# EAGLE design esquematico_proyecto (EAGLE 9.6.2)
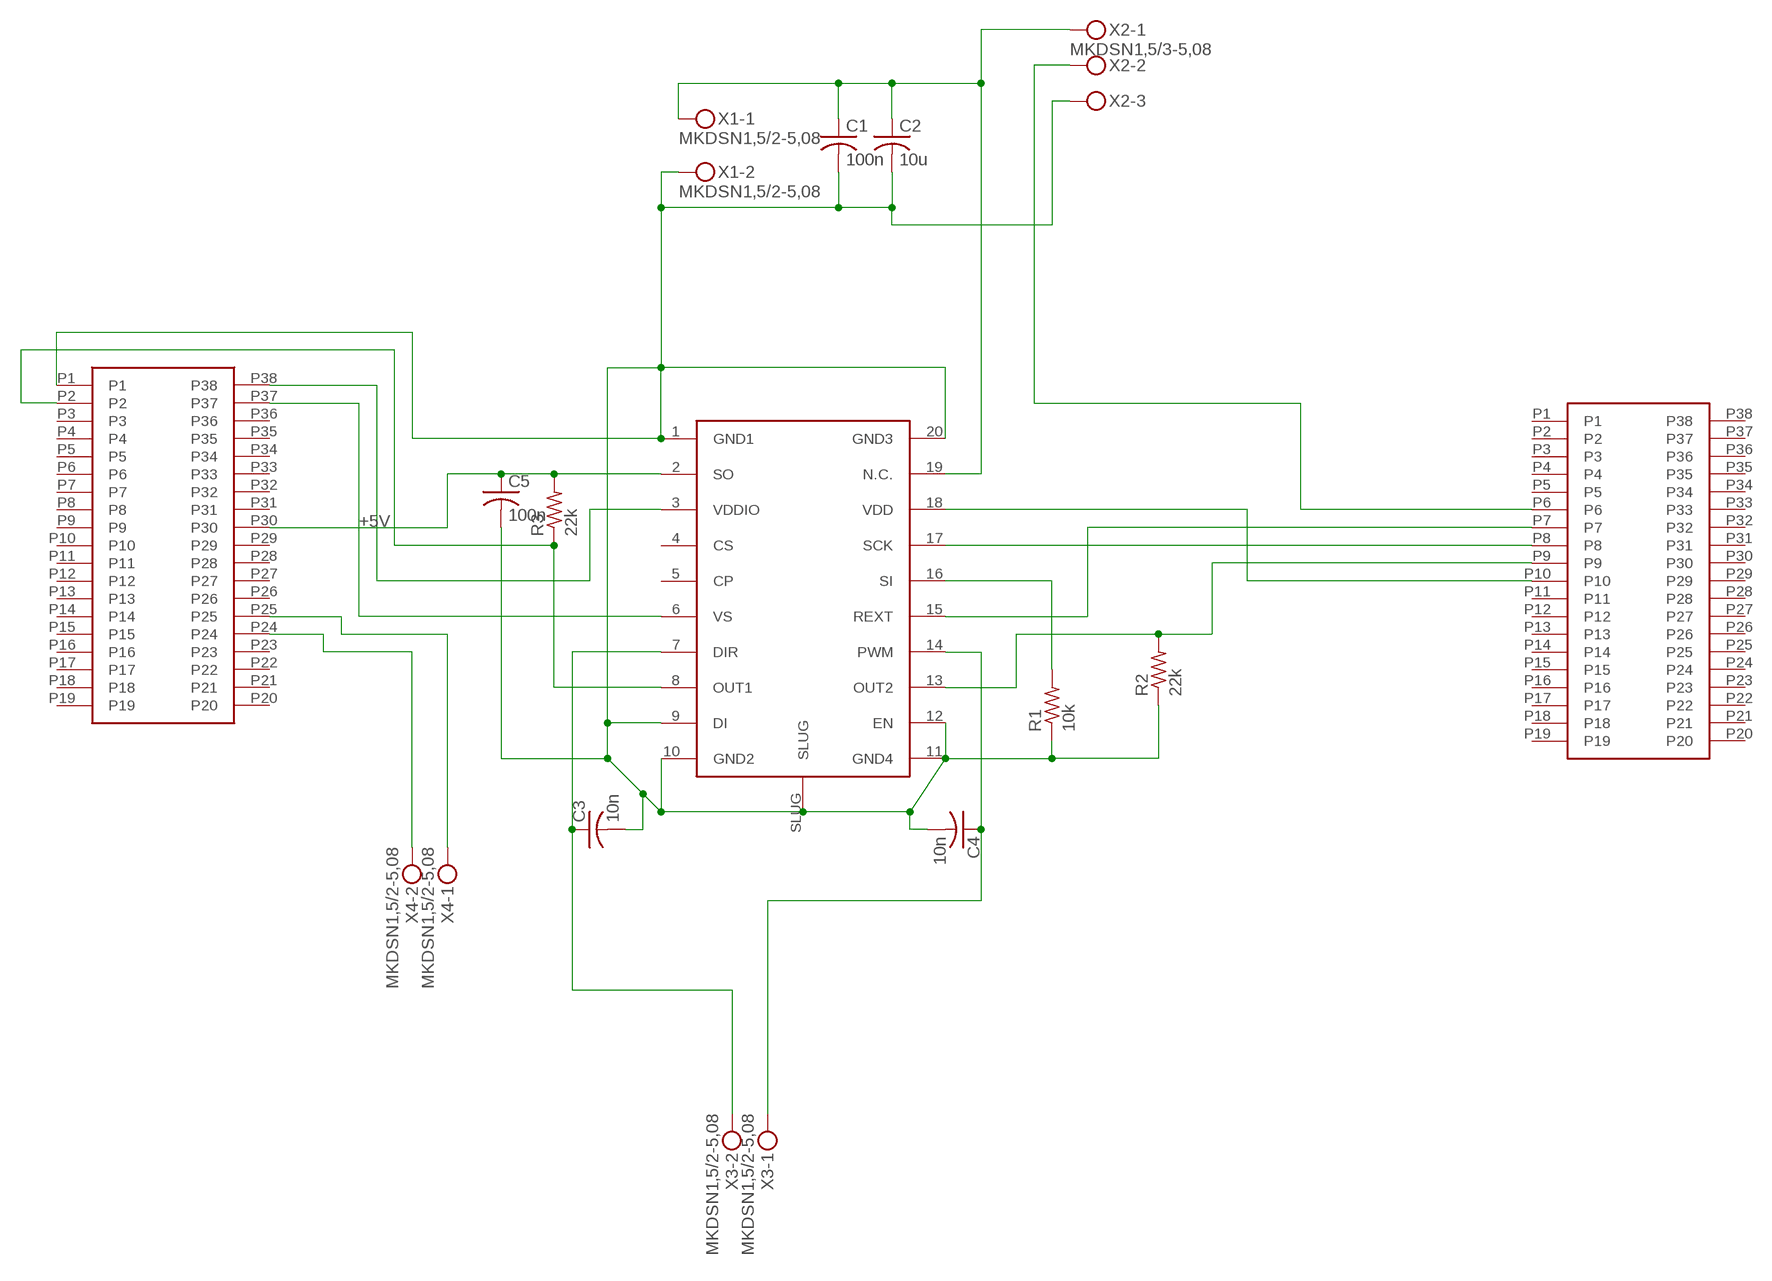
[diagram p0: schematic, sheet 1]

## Parts
C1  100n  C-USC0603  [C0603]
C2  10u  C-USC0805  [C0805]
C3  10n  C-USC0201  [C0201]
C4  10n  C-USC0201  [C0201]
C5  100n  C-USC0603  [C0603]
R1  10k  R-US_R0805  [R0805]
R2  22k  R-US_R0805  [R0805]
R3  22k  R-US_R0805  [R0805]
U$1  L9958L9958  [L9958]
U$2  PINHEADER  [PINHEADER]
U$3  PINHEADER  [PINHEADER]
X1  MKDSN1,5/2-5,08  [MKDSN1,5/2-5,08]
X2  MKDSN1,5/3-5,08  [MKDSN1,5/3-5,08]
X3  MKDSN1,5/2-5,08  [MKDSN1,5/2-5,08]
X4  MKDSN1,5/2-5,08  [MKDSN1,5/2-5,08]

## Nets
+5V: C5.1 R3.2 U$1.2(SO) U$2.P30
N$2: R1.2 U$1.16(SI)
N$3: R2.2 U$1.13(OUT2) U$3.P9
N$4: C1.1 C2.1 U$1.19(N.C.) X1.1 X2.1
N$5: C3.1 U$1.7(DIR) X3.2
N$6: C4.1 U$1.14(PWM) X3.1
N$7: R3.1 U$1.8(OUT1) U$2.P2
N$8: U$3.P6 X2.2
N$9: C1.2 C2.2 C3.2 C4.2 C5.2 R1.1 R2.1 U$1.1(GND1) U$1.9(DI) U$1.10(GND2) U$1.11(GND4) U$1.12(EN) U$1.20(GND3) U$1.SLUG U$2.P1 X1.2 X2.3
N$12: U$1.6(VS) U$2.P37
N$13: U$1.18(VDD) U$3.P10
N$14: U$1.17(SCK) U$3.P8
N$15: U$1.3(VDDIO) U$2.P38
N$16: U$1.15(REXT) U$3.P7
N$18: U$2.P25 X4.1
N$19: U$2.P24 X4.2
Unconnected: U$1.4(CS) U$1.5(CP) U$2.P3 U$2.P4 U$2.P5 U$2.P6 U$2.P7 U$2.P8 U$2.P9 U$2.P10 U$2.P11 U$2.P12 U$2.P13 U$2.P14 U$2.P15 U$2.P16 U$2.P17 U$2.P18 U$2.P19 U$2.P20 U$2.P21 U$2.P22 U$2.P23 U$2.P26 U$2.P27 U$2.P28 U$2.P29 U$2.P31 U$2.P32 U$2.P33 U$2.P34 U$2.P35 U$2.P36 U$3.P1 U$3.P2 U$3.P3 U$3.P4 U$3.P5 U$3.P11 U$3.P12 U$3.P13 U$3.P14 U$3.P15 U$3.P16 U$3.P17 U$3.P18 U$3.P19 U$3.P20 U$3.P21 U$3.P22 U$3.P23 U$3.P24 U$3.P25 U$3.P26 U$3.P27 U$3.P28 U$3.P29 U$3.P30 U$3.P31 U$3.P32 U$3.P33 U$3.P34 U$3.P35 U$3.P36 U$3.P37 U$3.P38

## Library data of the parts
C1 C2 C5 = CAPS:C-US: CAPACITOR, American symbol; SPICEPREFIX: C
C3 C4 = rcl:C-US: CAPACITOR, American symbol; SPICEPREFIX: C
R1-R3 = RES:R-US_: RESISTOR, American symbol; SPICEPREFIX: R
U$1 = L9958:L9958
U$2 U$3 = PINHEADER:PINHEADER
X1 = CONECTOR_POT:MKDSN1,5/2-5,08: MKDSN 1,5/ 2-5,08 Printklemme Nennstrom: 13,5 A Nennspannung: 250 V Rastermaß: 5,08 mm Polzahl: 2 Anschlussart: Schraubanschluss Montage: Löten Anschlussrichtung Leiter/Platine: 0 ° Artikelnummer: 1729128 Source: http://eshop.phoenixcontact.com .. 1729128.pdf
X2 = con-phoenix-508:MKDSN1,5/3-5,08: MKDSN 1,5/ 3-5,08 Printklemme Nennstrom: 13,5 A Nennspannung: 250 V Rastermaß: 5,08 mm Polzahl: 3 Anschlussart: Schraubanschluss Montage: Löten Anschlussrichtung Leiter/Platine: 0 ° Artikelnummer: 1729131 Source: http://eshop.phoenixcontact.com .. 1729131.pdf
X3 X4 = con-phoenix-508:MKDSN1,5/2-5,08: MKDSN 1,5/ 2-5,08 Printklemme Nennstrom: 13,5 A Nennspannung: 250 V Rastermaß: 5,08 mm Polzahl: 2 Anschlussart: Schraubanschluss Montage: Löten Anschlussrichtung Leiter/Platine: 0 ° Artikelnummer: 1729128 Source: http://eshop.phoenixcontact.com .. 1729128.pdf

## Board
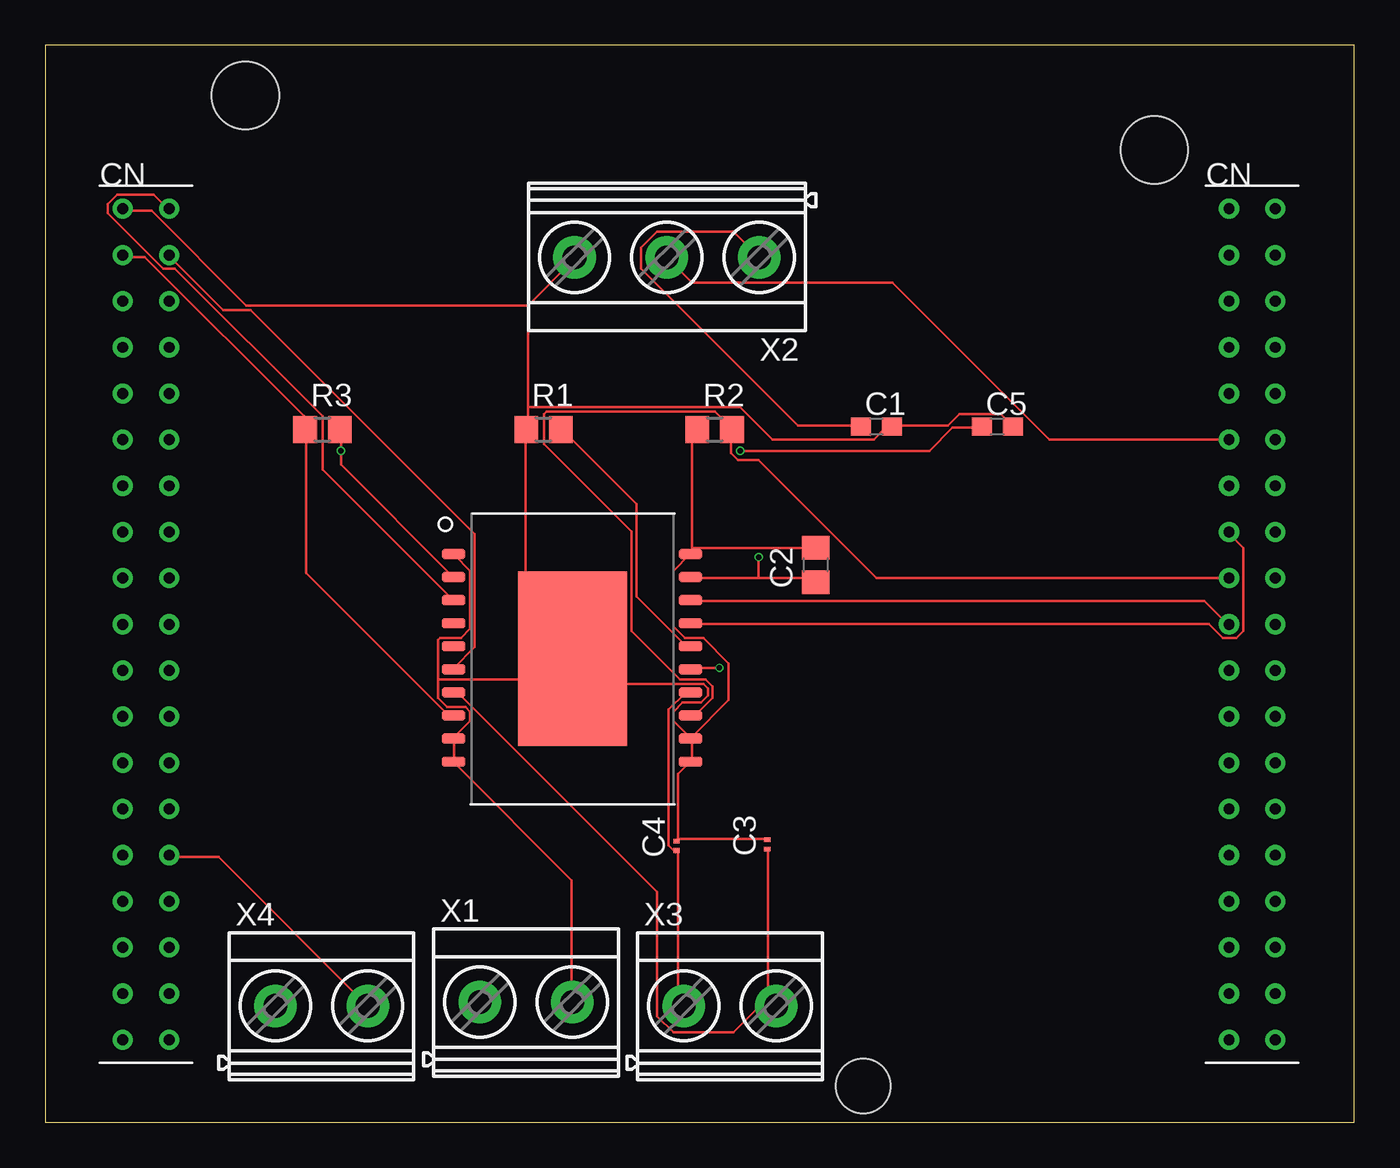
[diagram p1: board, top side]
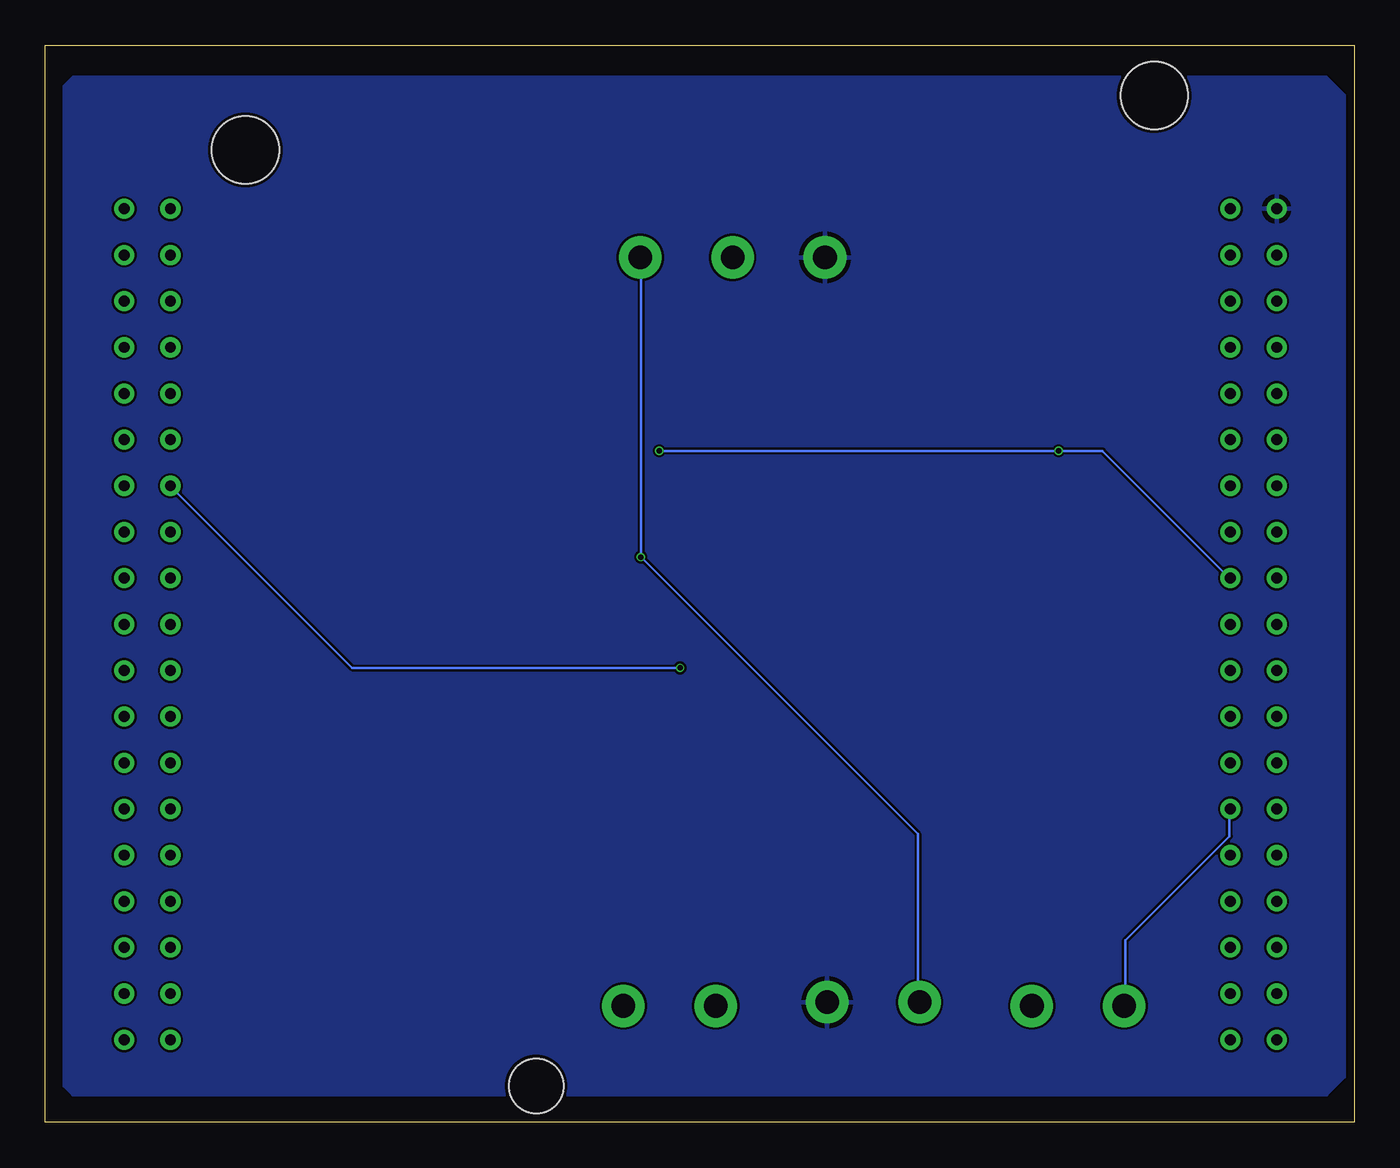
[diagram p2: board, bottom side, seen from below]

Size 72 x 59.25 mm. Coordinates in mm from the lower left corner, seen from the top.
Outline: 0,0 72,0 72,59.25 0,59.25 0,0
Copper layers (1*16): Top 0.035mm / dielectric 1.6mm / Bottom 0.035mm
Design rules "jlcpcb-2layers": minimum track width 5mil, minimum drill 0.3mm, track to track 5mil, track to pad 5mil, pad to pad 5mil, via to via 5mil, smd to smd 5mil, copper to edge 0.2mm, drill to drill 6mil, minimum pad ring 10mil, minimum via ring 3mil, stop-mask expansion 4mil, vias tented up to drill 0mil, thermal gap 10mil
Holes 3.7 mm at 11,56.5 61,53.5
Holes 3 mm at 45,2

### Footprints (pad centres in the part's own frame; a part is rotated, then mirrored left to right if it is on the bottom)
C0603 = smd 1.1 x 1: 1 -0.85,0; 2 0.85,0
C0805 = smd 1.3 x 1.5: 1 -0.95,0; 2 0.95,0
C0201 = smd 0.25 x 0.35: 1 -0.25,0; 2 0.25,0
R0805 = smd 1.3 x 1.5: 1 -0.95,0; 2 0.95,0
L9958 = smd 1.3 x 0.53: 1 -6.548,5.77; 2 -6.548,4.5; 3 -6.548,3.23; 4 -6.548,1.96; 5 -6.548,0.69; 6 -6.548,-0.58; 7 -6.548,-1.85; 8 -6.548,-3.12; 9 -6.548,-4.39; 10 -6.548,-5.66; 11 6.495,-5.66; 12 6.495,-4.39; 13 6.495,-3.12; 14 6.495,-1.85; 15 6.495,-0.58; 16 6.495,0.69; 17 6.495,1.96; 18 6.495,3.23; 19 6.495,4.5; 20 6.495,5.77 | smd 6 x 9.6: SLUG 0,0
PINHEADER = drill 0.6 pad 1.02: P1 -1.27,22.86; P2 -1.27,20.32; P3 -1.27,17.78; P4 -1.27,15.24; P5 -1.27,12.7; P6 -1.27,10.16; P7 -1.27,7.62; P8 -1.27,5.08; P9 -1.27,2.54; P10 -1.27,0; P11 -1.27,-2.54; P12 -1.27,-5.08; P13 -1.27,-7.62; P14 -1.27,-10.16; P15 -1.27,-12.7; P16 -1.27,-15.24; P17 -1.27,-17.78; P18 -1.27,-20.32; P19 -1.27,-22.86; P20 1.27,-22.86; P21 1.27,-20.32; P22 1.27,-17.78; P23 1.27,-15.24; P24 1.27,-12.7; P25 1.27,-10.16; P26 1.27,-7.62; P27 1.27,-5.08; P28 1.27,-2.54; P29 1.27,0; P30 1.27,2.54; P31 1.27,5.08; P32 1.27,7.62; P33 1.27,10.16; P34 1.27,12.7; P35 1.27,15.24; P36 1.27,17.78; P37 1.27,20.32; P38 1.27,22.86
MKDSN1,5/2-5,08 = drill 1.3 pad 2: 1 -2.561,0.025; 2 2.519,0.025
MKDSN1,5/3-5,08 = drill 1.3 pad 2: 1 -7.641,0.025; 2 -2.561,0.025; 3 2.519,0.025

### Placement (x,y rotation side)
C1  45.72,38.28 0 top
C2  42.38,30.66 90 top
C3  39.72,15.29 90 top
C4  34.72,15.21 90 top
C5  52.37,38.28 0 top
R1  27.4,38.12 0 top
R2  36.82,38.12 0 top
R3  15.24,38.12 0 top
U$1  29,25.5 0 top
U$2  5.53,27.4 0 top
U$3  66.39,27.4 0 top
X1  26.47,6.58 0 top
X2  31.63,47.61 180 top
X3  37.68,6.38 0 top
X4  15.21,6.38 0 top

### Tracks (layer width: path | path; a pad name or v marks a point on that pad's centre or on a via)
+5V  (via drill 0.3)
  Top 0.127: U$1.2 22.35,30.08 16.26,36.18 v16.26,36.94 16.26,38.08 R3.2 | v38.23,36.94 48.64,36.94 49.91,38.21 51.44,38.21 C5.1
  Bottom 0.127: v38.23,36.94 v16.26,36.94 13.84,36.94 6.86,29.96 U$2.P30
N$2
  Top 0.127: U$1.16 35.43,26.27 35.18,26.27 32.51,28.94 32.51,34.02 28.45,38.08 R1.2
N$3
  Top 0.127: U$1.13 35.56,22.46 35.81,22.46 36.7,23.35 36.7,23.99 36.32,24.37 34.92,24.37 32.26,27.04 32.26,32.5 27.43,37.32 27.43,38.97 27.56,39.1 36.83,39.1 37.72,38.21 R2.2 37.72,38.08 37.72,36.81 38.1,36.43 39.24,36.43 45.72,29.96 65.02,29.96 U$3.P9
N$4  (via drill 0.3)
  Top 0.127: 39.24,29.96 42.16,29.96 42.29,29.83 C2.1 | 39.24,29.96 35.56,29.96 U$1.19 | C1.1 44.83,38.34 41.4,38.34 32.77,46.97 32.77,48.12 33.66,49.01 37.85,49.01 39.24,47.61 X2.1 | v39.24,31.1 39.24,29.96
  Bottom 0.127: X2.1 39.24,47.48 v39.24,31.1 24,15.86 24,6.71 X1.1
N$5
  Top 0.127: 39.75,6.84 39.75,14.97 C3.1 | 39.75,6.84 40.13,6.46 X3.2 39.75,6.84 | 39.75,6.84 37.85,4.94 34.54,4.94 33.66,5.83 33.66,12.68 22.73,23.61 22.48,23.61 U$1.7
N$6
  Top 0.127: X3.1 35.05,6.46 34.8,6.71 34.8,14.84 C4.1 34.67,14.84 34.29,15.22 34.29,22.72 35.18,23.61 35.43,23.61 U$1.14
N$7
  Top 0.127: U$1.8 22.35,22.46 22.1,22.46 14.35,30.21 14.35,38.08 R3.1 14.22,38.21 14.22,38.85 5.46,47.61 4.32,47.61 U$2.P2
N$8
  Top 0.127: U$3.P6 65.02,37.58 55.24,37.58 46.61,46.21 35.56,46.21 34.29,47.48 X2.2
N$9
  Top 0.127: 21.59,24.37 21.59,23.35 22.1,22.84 23.11,22.84 23.37,22.59 23.37,22.08 22.48,21.19 U$1.9 22.48,21.07 22.48,19.92 U$1.10 22.48,19.8 28.96,13.32 28.96,6.71 X1.2 | 21.59,24.37 21.59,26.53 21.72,26.65 22.86,26.65 23.37,27.16 23.37,30.34 22.48,31.23 U$1.1 | 35.56,31.61 35.56,37.83 35.81,38.08 R2.1 | 35.56,31.61 35.56,31.35 U$1.20 35.43,31.23 34.54,30.34 34.54,27.29 35.18,26.65 36.2,26.65 37.59,25.26 37.59,23.23 35.56,21.19 U$1.12 | 35.56,31.61 42.29,31.61 C2.2 | 34.8,15.61 34.8,19.16 35.43,19.8 U$1.11 35.56,19.92 35.56,21.07 U$1.12 | 34.8,15.61 34.8,15.48 C4.2 | 34.8,15.61 39.62,15.61 C3.2 | U$1.12 35.43,21.19 34.54,22.08 34.54,22.59 35.05,23.1 36.07,23.1 36.45,23.48 36.45,23.86 36.2,24.11 30.35,24.11 29.08,25.38 U$1.SLUG | 26.42,24.37 27.94,24.37 28.96,25.38 U$1.SLUG | 26.42,24.37 21.59,24.37 | C5.2 53.21,38.34 52.58,38.97 50.29,38.97 49.66,38.34 46.61,38.34 C1.2 46.48,38.21 46.23,38.21 45.59,37.58 40.01,37.58 38.23,39.35 26.54,39.35 | 26.54,44.94 26.54,39.35 | 26.54,39.35 26.54,38.21 R1.1 26.42,38.08 26.42,24.37 | 26.54,44.94 29.08,47.48 X2.3 | 26.54,44.94 11.05,44.94 5.84,50.15 4.32,50.15 U$2.P1 | 26.42,24.37 U$1.SLUG
  pour Bottom: 1.5,57.5 70.5,57.5 71,57 71,2 70.5,1.5 3,1.5 2.5,1.5 1.5,1.5 0.5,2.5 0.5,56.5
N$12
  Top 0.127: U$1.6 22.48,25 23.62,26.15 23.62,32.37 11.3,44.69 9.78,44.69 6.86,47.61 U$2.P37
N$13
  Top 0.127: U$1.18 35.56,28.69 63.75,28.69 65.02,27.42 U$3.P10
N$14
  Top 0.127: U$1.17 35.56,27.42 64.01,27.42 64.77,26.65 65.53,26.65 65.91,27.04 65.91,31.61 65.15,32.37 U$3.P8
N$15
  Top 0.127: U$1.3 22.35,28.81 15.24,35.92 15.24,38.85 7.11,46.97 6.48,46.97 3.43,50.02 3.43,50.53 3.94,51.04 5.97,51.04 6.73,50.28 U$2.P38
N$16  (via drill 0.3)
  Top 0.127: v37.08,25 35.56,25 U$1.15
  Bottom 0.127: v37.08,25 55.12,25 65.02,34.91 U$3.P7
N$18
  Bottom 0.127: U$2.P25 6.86,17.13 6.86,15.73 12.57,10.02 12.57,6.46 X4.1
N$19
  Top 0.127: U$2.P24 6.86,14.59 9.53,14.59 17.65,6.46 X4.2